# EAGLE schematic unnamed-programmer (EAGLE 9.5.2)
COMPANY: Pepetech; CREVISION: 1.0; DESIGNER: Joao Silva & Rafael Silva; LICENSE: Creative Commons Attribution-ShareAlike 3.0 Unported License; LINK: https://github.com/pepetech/unnamed-programmer
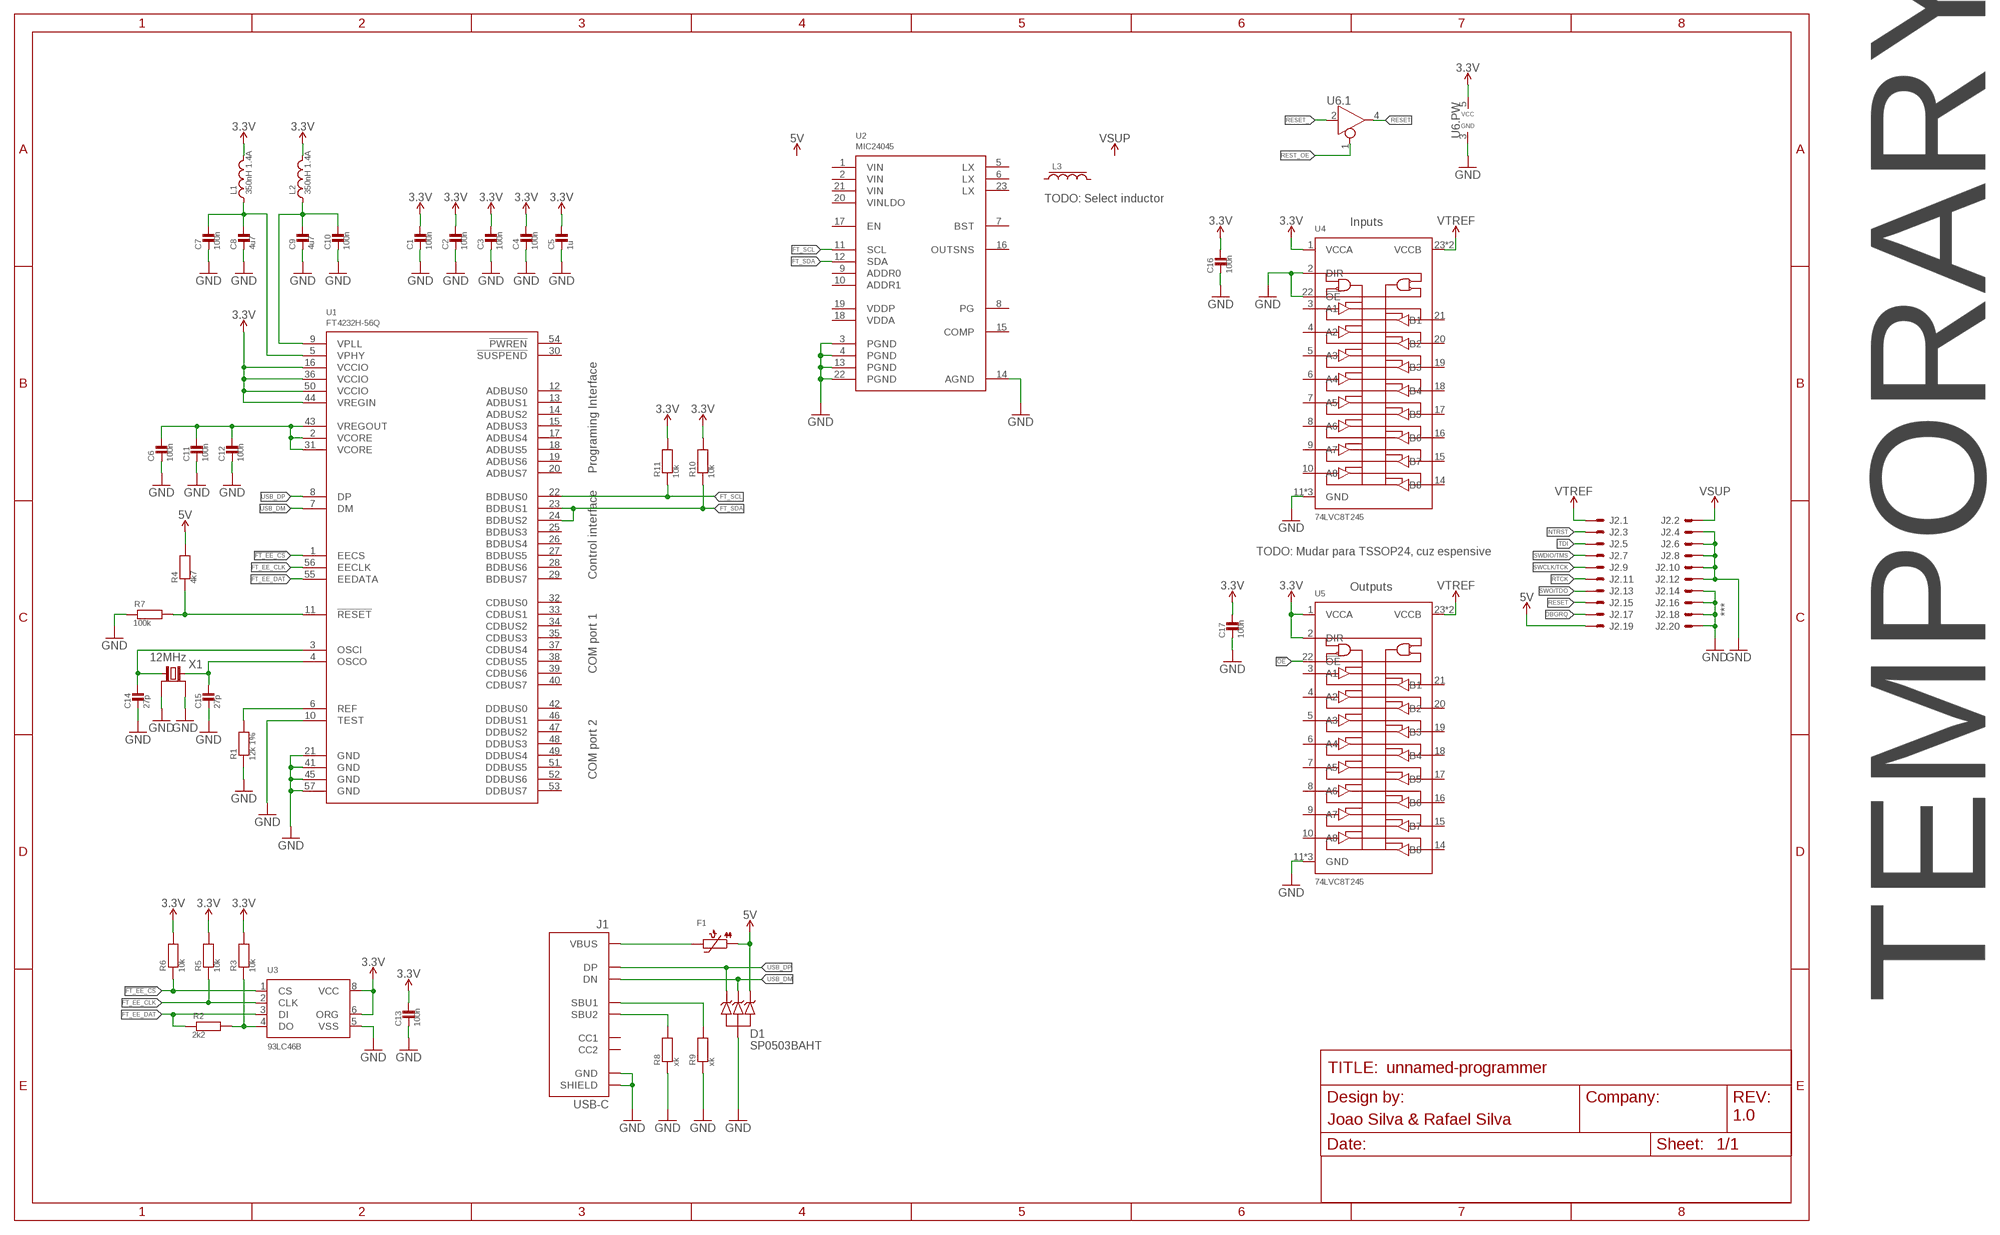
[diagram p0: schematic, sheet 1]

## Parts
C1  100n  MLCC0603  [0603_WAVE]
C2  100n  MLCC0603  [0603_WAVE]
C3  100n  MLCC0603  [0603_WAVE]
C4  100n  MLCC0603  [0603_WAVE]
C5  1u  MLCC0603  [0603_WAVE]
C6  100n  MLCC0603  [0603_WAVE]
C7  100n  MLCC0603  [0603_WAVE]
C8  4u7  MLCC0603  [0603_WAVE]
C9  4u7  MLCC0603  [0603_WAVE]
C10  100n  MLCC0603  [0603_WAVE]
C11  100n  MLCC0603  [0603_WAVE]
C12  100n  MLCC0603  [0603_WAVE]
C13  100n  MLCC0603  [0603_WAVE]
C14  27p  MLCC0603  [0603_WAVE]
C15  27p  MLCC0603  [0603_WAVE]
C16  100n  MLCC0603  [0603_WAVE]
C17  100n  MLCC0603  [0603_WAVE]
D1  SP0503BAHT  [SOT143]
F1  PTC0805  [0805]
J1  USB-C  [USB-C]
J2  20  [2X10_2.54]
L1  350nH 1.4A  INDUCTOR_NC_0603  [_0603]
L2  350nH 1.4A  INDUCTOR_NC_0603  [_0603]
L3  INDUCTOR_6X6MM  [_6X6MM]
R1  12k 1%  RESISTOR0603  [0603_WAVE]
R2  2k2  RESISTOR0603  [0603_WAVE]
R3  10k  RESISTOR0603  [0603_WAVE]
R4  4k7  RESISTOR0603  [0603_WAVE]
R5  10k  RESISTOR0603  [0603_WAVE]
R6  10k  RESISTOR0603  [0603_WAVE]
R7  100k  RESISTOR0603  [0603_WAVE]
R8  xk  RESISTOR0603  [0603_WAVE]
R9  xk  RESISTOR0603  [0603_WAVE]
R10  10k  RESISTOR0603  [0603_WAVE]
R11  10k  RESISTOR0603  [0603_WAVE]
U1  FT4232H-56Q  [QFN56]
U2  MIC24045  [FQFN20]
U3  93LC46B  [TDFN-8]
U4  74LVC8T245  [SOT815-1]
U5  74LVC8T245  [SOT815-1]
U6  74LVC1G125  [SC70-5]
X1  12MHz  CRYSTAL_4P  [4-SMD-3225]

## Nets
3.3V: C1.P$1 C2.P$1 C3.P$1 C4.P$1 C5.P$1 C13.P$1 C16.P$1 C17.P$1 L1.2 L2.2 R3.P$2 R5.P$2 R6.P$2 U1.16(VCCIO) U1.36(VCCIO) U1.44(VREGIN) U1.50(VCCIO) U3.6(ORG) U3.8(VCC) U4.1(VCCA) U5.1(VCCA) U5.2(DIR) U6.5(.PW:VCC)
3.3V1: R10.P$2 R11.P$2 ; supply symbol labelled 3.3V
5V: D1.4 F1.1 J2.19 R4.P$2
!FT_EE_CS: R6.P$1 U1.1(EECS) U3.1(CS)
!OE: U5.22(!OE)
DBGRQ: J2.17
FT_EE_CLK: R5.P$1 U1.56(EECLK) U3.2(CLK)
FT_EE_DAT: R2.P$1 U1.55(EEDATA) U3.3(DI)
FT_SCL: R11.P$1 U1.22(BDBUS0) U2.11(SCL)
FT_SDA: R10.P$1 U1.23(BDBUS1) U1.24(BDBUS2) U2.12(SDA)
GND: C1.P$2 C2.P$2 C3.P$2 C4.P$2 C5.P$2 C6.P$2 C7.P$2 C8.P$2 C9.P$2 C10.P$2 C11.P$2 C12.P$2 C13.P$2 C14.P$2 C15.P$2 C16.P$2 C17.P$2 D1.1 J1.A1/B12(GND) J1.B1/A12(GND) J1.SHIELD0(SHIELD) J1.SHIELD1(SHIELD) J1.SHIELD2(SHIELD) J1.SHIELD3(SHIELD) J2.4 J2.6 J2.8 J2.10 J2.12 J2.14 J2.16 J2.18 J2.20 R1.P$1 R7.P$1 R8.P$1 R9.P$1 U1.10(TEST) U1.21(GND) U1.41(GND) U1.45(GND) U1.57(GND) U2.3(PGND) U2.4(PGND) U2.13(PGND) U2.14(AGND) U2.22(PGND) U3.5(VSS) U4.2(DIR) U4.11(GND) U4.12(GND) U4.13(GND) U4.22(!OE) U5.11(GND) U5.12(GND) U5.13(GND) U6.3(.PW:GND) X1.2(GND) X1.4(GND)
N$1: R1.P$2 U1.6(REF)
N$2: C6.P$1 C11.P$1 C12.P$1 U1.2(VCORE) U1.31(VCORE) U1.43(VREGOUT)
N$3: C9.P$1 C10.P$1 L2.1 U1.9(VPLL)
N$4: C7.P$1 C8.P$1 L1.1 U1.5(VPHY)
N$5: R2.P$2 R3.P$1 U3.4(DO)
N$6: C15.P$1 U1.4(OSCO) X1.3
N$7: R4.P$1 R7.P$2 U1.11(!RESET)
N$8: C14.P$1 U1.3(OSCI) X1.1
N$9: F1.2 J1.A4/B9(VBUS) J1.B4/A9(VBUS)
N$10: J1.B8(SBU2) R8.P$2
N$11: J1.A8(SBU1) R9.P$2
NTRST: J2.3
RESET: J2.15 U6.4(.1:Y)
RESET_: U6.2(.1:A)
REST_OE: U6.1(.1:OE)
RTCK: J2.11
SWCLK/TCK: J2.9
SWDIO/TMS: J2.7
SWO/TDO: J2.13
TDI: J2.5
USB_DM: D1.3 J1.A7(DN) J1.B7(DN) U1.7(DM)
USB_DP: D1.2 J1.A6(DP) J1.B6(DP) U1.8(DP)
VSUP: J2.2
VTREF: J2.1 U4.23(VCCB) U4.24(VCCB) U5.23(VCCB) U5.24(VCCB)
Unconnected: J1.A5(CC1) J1.B5(CC2) L3.P$1 L3.P$2 U1.12(ADBUS0) U1.13(ADBUS1) U1.14(ADBUS2) U1.15(ADBUS3) U1.17(ADBUS4) U1.18(ADBUS5) U1.19(ADBUS6) U1.20(ADBUS7) U1.25(BDBUS3) U1.26(BDBUS4) U1.27(BDBUS5) U1.28(BDBUS6) U1.29(BDBUS7) U1.30(!SUSPEND) U1.32(CDBUS0) U1.33(CDBUS1) U1.34(CDBUS2) U1.35(CDBUS3) U1.37(CDBUS4) U1.38(CDBUS5) U1.39(CDBUS6) U1.40(CDBUS7) U1.42(DDBUS0) U1.46(DDBUS1) U1.47(DDBUS2) U1.48(DDBUS3) U1.49(DDBUS4) U1.51(DDBUS5) U1.52(DDBUS6) U1.53(DDBUS7) U1.54(!PWREN) U2.1(VIN) U2.2(VIN) U2.5(LX) U2.6(LX) U2.7(BST) U2.8(PG) U2.9(ADDR0) U2.10(ADDR1) U2.15(COMP) U2.16(OUTSNS) U2.17(EN) U2.18(VDDA) U2.19(VDDP) U2.20(VINLDO) U2.21(VIN) U2.23(LX) U4.3(A1) U4.4(A2) U4.5(A3) U4.6(A4) U4.7(A5) U4.8(A6) U4.9(A7) U4.10(A8) U4.14(B8) U4.15(B7) U4.16(B6) U4.17(B5) U4.18(B4) U4.19(B3) U4.20(B2) U4.21(B1) U5.3(A1) U5.4(A2) U5.5(A3) U5.6(A4) U5.7(A5) U5.8(A6) U5.9(A7) U5.10(A8) U5.14(B8) U5.15(B7) U5.16(B6) U5.17(B5) U5.18(B4) U5.19(B3) U5.20(B2) U5.21(B1)

## Notes on the sheet
- TODO: Select inductor
- Inputs
- Programing Interface
- TODO: Mudar para TSSOP24, cuz espensive
- Control interface
- Outputs
- ***
- COM port 1
- COM port 2
- JTAG interface connection (20 pin
  )J-Link and J-Trace have a JTAG connector compatible to ARM's Multi-ICE. The JTAG connector is a 20 way Insulation Displacement Connector (IDC) keyed box header(2.54mm male) that mates with IDC sockets mounted on a ribbon cable.
  *On later J-Link products like the J-Link ULTRA+, these pinsare reserved for firmware extension purposes. They can be left open or connected to GND in normal debug environment. They are not essential for JTAG/SWD in general.
  The following table lists the J-Link / J-Trace JTAG pinout.
  
  
  Pin Signal Type Description
  
  1 VTref Input This is the target reference voltage.It is used to check if the target has power, to create the logic-level reference for the input comparators and to control the output logic levels to the target. It is normally fed from Vdd of the target board and must not have a series resistor.
  2 Not connected NC This pin is not connected in J-Link.It is reserved for compatibility with other equipment.Connect to Vdd or leave open in target system.
  3 nTRST Output JTAG Reset. Output from J-Link to the Reset signal of the target JTAG port. Typically connected to nTRST of the target CPU. This pin is normally pulled HIGH on the target to avoid unin-tentional resets when there is no connection.
  5 TDI Output JTAG data input of target CPU.It is recommended that this pin is pulled to a defined state on the target board. Typically connected to TDI of target CPU.
  7 TMS Output JTAG mode set input of target CPU.This pin should be pulled up on the target. Typically connected to TMS of target CPU.
  9 TCK Output JTAG clock signal to target CPU.It is recommended that this pin is pulled to a defined state of the target board. Typically connected to TCK of target CPU.
  11 RTCK Input Return test clock signal from the target.Some targets must synchronize the JTAG inputs to internal clocks. To assist in meeting this requirement, you can use a returned, and retimed, TCK to dynamically control the TCK rate. J-Link supports adaptive clocking, which waits for TCK changes to be echoed correctly before making further changes. Connect to RTCK if available, otherwise to GND.
  13 TDO Input JTAG data output from target CPU.Typically connected to TDO of target CPU.
  15 RESET I/O Target CPU reset signal. Typically connected to the RESET pin of the target CPU, which is typically called "nRST", "nRESET" or "RESET".
  17 DBGRQ NC This pin is not connected in J-Link.It is reserved for compatibility with other equipment to be used as a debug request signal to the target system. Typically connected to DBGRQ if available, otherwise left open.
  19 5V-Target supply Output This pin can be used to supply power to the target hardware. 
  
  Notes 
  All pins marked NC are not connected inside J-Link. Any signal can be applied here; J-Link will simply ignore such a signal.
  
  Pins 4, 6, 8, 10, 12, 14, 16, 18, 20 are GND pins connected to GND in J-Link. They should also be connected to GND in the target system.
  
  Pin 2 is not connected inside J-Link. A lot of targets have pin 1 and pin 2 connected. Some targets use pin 2 instead of pin 1 to supply VCC. These targets will not work with J-Link, unless Pin 1 and Pin 2 are connected on the target's JTAG connector.
  
  Pin 3 (TRST)should be connected to target CPUs TRST pin (sometimes called NTRST). J-Link will also work if this pin is not connected, but you may experience some limitations when debugging. TRST should be separate from the CPU Reset (pin 15 )
  
  Pin 11 (RTCK)should be connected to RTCK if available, otherwise to GND.
  
  Pin 19 (5V-Target supply)of the connector can be used to supply power to the target hardware. Supply voltage is 5V, max. current is 300mA. The output current is monitored and protected against overload and short-circuit.
  
  SWD and SWO/SWV (also called SWV) compatibility
  SWD overview
  The J-Link and J-Trace support ARMs Serial Wire Debug (SWD). SWD replaces the 5-pin JTAG port with a clock (SWDCLK) and a single bi-directional data pin (SWDIO), providing all the normal JTAG debug and test functionality. SWDIO and SWCLK are overlaid on the TMS and TCK pins. In order to communicate with a SWD device, J-Link sends out data on SWDIO, syn-chronous to the SWCLK. With every rising edge of SWCLK, one bit of data is trans-mitted or received on the SWDIO. The data read from SWDIO can than be retrieved from the input buffer.
  SWD connector pinout
  The J-Link and J-Trace JTAG connector is also compatible to ARM's Serial Wire Debug (SWD).
  
  *On later J-Link products like the J-Link ULTRA+, these pins are reserved for firmware extension purposes. They can be left open or connected to GND in normal debug environment. They are not essential for JTAG/SWD in general.
  
  The following table lists the J-Link / J-Trace SWD pinout.
  
  Pin Signa lType Description
  1 VTref Input This is the target reference voltage. It is used to check if the target has power, to create the logic-level reference for the input comparators and to control the output logic levels to the target. It is normally fed from Vdd of the target board and must not have a series resistor.
  2 Vsupply NC This pin is not connected in J-Link. It is reserved for compatibility with other equipment. Connect to Vdd or leave open in target system.
  3 Not used NC This pin is not used by J-Link. If the device may also be accessed via JTAG, this pin may be connectedto nTRST, otherwise leave open.
  5 Not used NC This pin is not used by J-Link. If the device may also be accessed via JTAG, this pin may be connected to TDI, otherwise leave open.
  7 SWDIO I/O Single bi-directional data pin.
  9 SWCLK Output Clock signal to target CPU. It is recommended that this pin is pulled to a defined state of the target board. Typically connected to TCK of target CPU.
  11 Not used NC This pin is not used by J-Link. This pin is not used by J-Link when operating in SWD mode. If the device may also be accessed via JTAG, this pin may be connected to RTCK, otherwise leave open.
  13 SWO OutputSerial Wire Output trace port. (Optional, not required for SWD communication.)
  15 RESET I/O Target CPU reset signal. Typically connected to the RESET pin of the target CPU, which is typically called "nRST", "nRESET" or "RESET".
  17 Not used NC This pin is not connected in J-Link.
  19 5V-Supply Output This pin is used to supply power to some eval boards. Not all JLinks supply power on this pin, only the KS (Kickstart) versions. Typically left open on target hardware.
  
  Pins 4, 6, 8, 10, 12, 14, 16, 18, 20 are GND pins connected to GND in J-Link. They should also be connected to GND in the target system.
  Serial Wire Output (SWO) overview
  J-Link can be used with devices that supports Serial Wire Output (SWO). Serial Wire Output (SWO) support means support for a single pin output signal from the core. It is currently tested with Cortex-M3 only.
  Serial Wire Viewer (SWV) overview
  The Instrumentation Trace Macrocell (ITM) and Serial Wire Output (SWO) can be used to form a Serial Wire Viewer (SWV). The Serial Wire Viewer provides a low cost method of obtaining information from inside the MCU. The SWO can output trace data in two output formats, but only one output mechanism is valid at any one time. The 2 defined encodings are UART and Manchester. The current J-Link implementation supports only UART encoding. Serial Wire Viewer uses the SWO pin to transmit different packets for different types of information. The three sources in the Cortex-M3 core which can output information viathis pin are:
  •Instrumentation Trace Macrocell (ITM) for application-driven trace source that supports printf-style debugging. It supports 32 different channels, which allow it to be used for other purposes such as real-time kernel information as well.
  •Data Watchpoint and Trace (DWT) for real-time variable monitoring and PC-sampling, which can in turn be used to periodically output the PC or various CPU-internal counters, which can be used to obtain profiling information from the target.
  •Timestamping. Timestamps are emitted relative to packets.
  Further application documents
  Refer to the following documents for detailed information about SWO/SWV:
  
  https://www.mperl.com/uploads/2/2/3/1/22310458/jlink_pinout.pdf
- TEMPORARY

## Library data of the parts
C1-C17 = Passive Components > Capacitors > Multilayer Ceramic Capacitors MLCC:MLCC: KEMET’s X7R dielectric features a 125°C maximum operating temperature and is considered temperature stable. The Electronics Components, Assemblies and Materials Association (EIA) characterizes X7R dielectric as a Class II material. Components of this classification are fixed, ceramic dielectric capacitors suited for bypass and decoupling applications or for frequency discriminating circuits where Q and stability of capacitance characteristics are not critical. X7R exhibits a predictable change in capacitance with respect to time and voltage, boasting a minimal change in capacitance with reference to ambient temperature. Capacitance change is limited to ±15% from −55°C to +125°C.
D1 = Circuit Protection > ESD Suppressors \ TVS Diodes:SP0503BAHT
F1 = Circuit Protection > Resettable Fuses - PPTC:PTC
J1 = Connectors > USB:USB-C
J2 = Connectors > Header:20
L1 L2 = Passive Components > Inductors, Chokes & Coils:INDUCTOR_NC
L3 = Passive Components > Inductors, Chokes & Coils:INDUCTOR
R1-R11 = Passive Components > Resistors > Chip Resistors:RESISTOR: Resistors For new designs, use the packages preceded by an '_' character since they are more reliable: The following footprints should be used on most boards: _0402 - Standard footprint for regular board layouts _0603 - Standard footprint for regular board layouts _0805 - Standard footprint for regular board layouts _1206 - Standard footprint for regular board layouts For extremely tight-pitch boards where space is at a premium, the following 'micro-pitch' footprints can be used (smaller pads, no silkscreen outline, etc.): _0402MP - Micro-pitch footprint for very dense/compact boards _0603MP - Micro-pitch footprint for very dense/compact boards _0805MP - Micro-pitch footprint for very dense/compact boards _1206MP - Micro-pitch footprint for very dense/compact boards
U1 = Semiconductors > Integrated Circuits - ICs > Interface ICs > USB Interface IC:FT4232H
U2 = Power > Switching Controllers:MIC24045
U3 = Semiconductors > Integrated Circuits - ICs > Memory ICs > EEPROM:93LC46B
U4 U5 = Semiconductors > Integrated Circuits - ICs > Logic ICs > Logic Gates:74LVC8T245
U6 = Semiconductors > Integrated Circuits - ICs > Logic ICs > Logic Gates:74LVC1G125
X1 = Passive Components > Frequency Control & Timing Devices > Crystals:CRYSTAL_4P